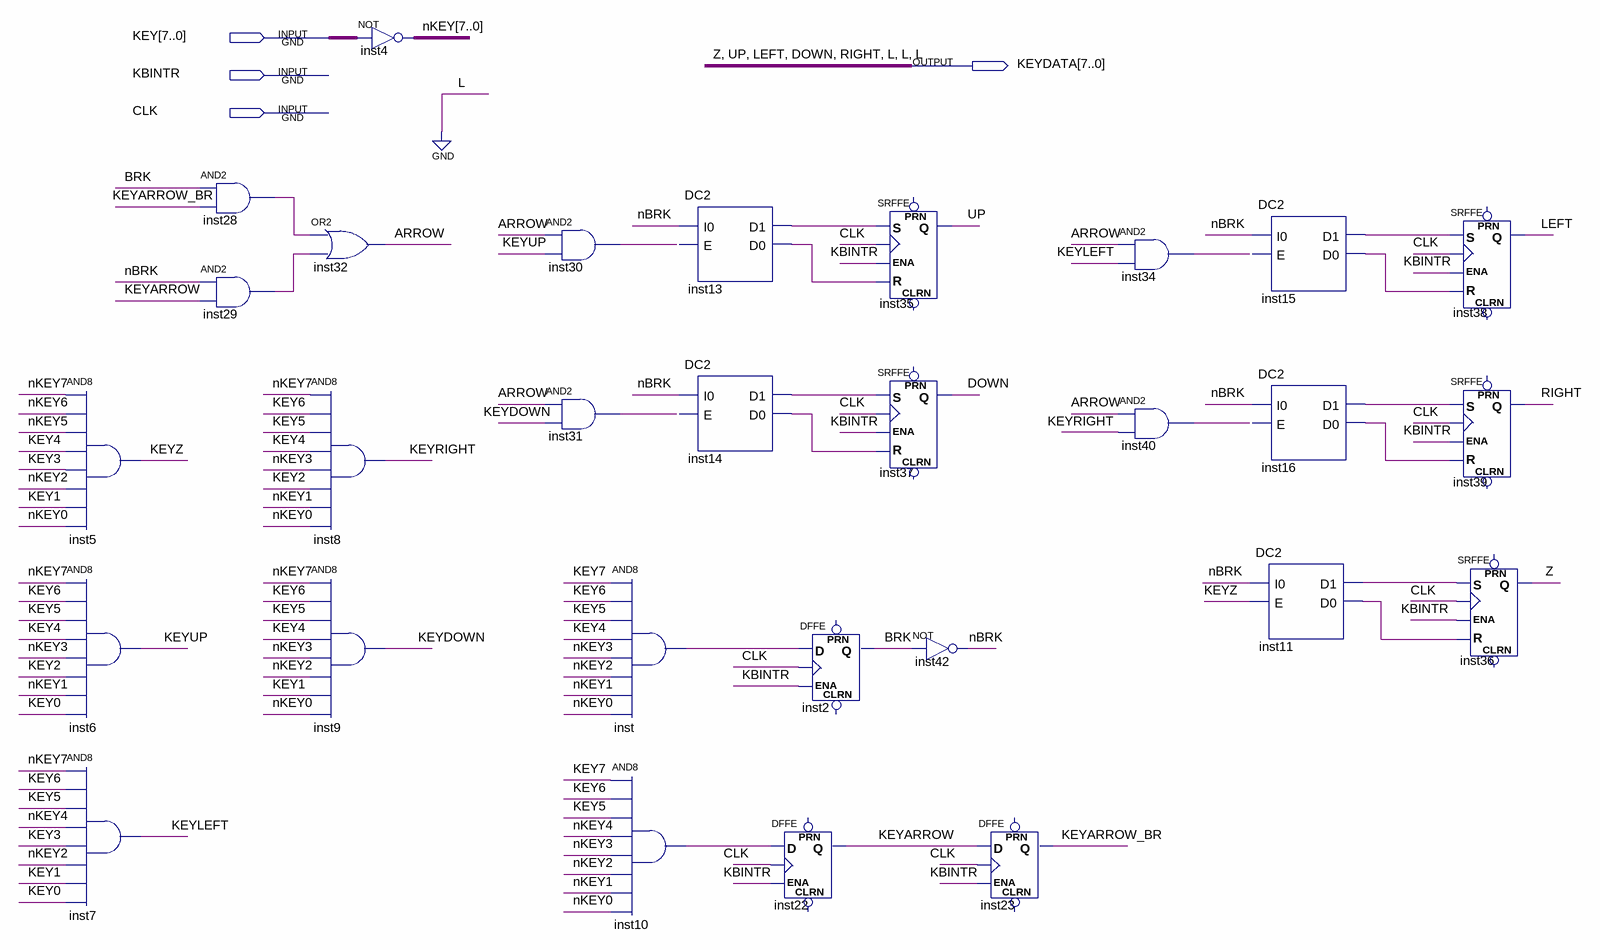
[diagram p0: schematic sheet]
// Quartus schematic CodeInterpeter.bdf as structural Verilog: 29 symbols, 4 pins
module CodeInterpeter (
  input  [7:0] KEY,
  input  KBINTR,
  input  CLK,
  output [7:0] KEYDATA
);

  wire ARROW, BRK, inst10_out, inst11_d0, inst11_d1, inst13_d0, inst13_d1, inst14_d0, inst14_d1, inst15_d0,
       inst15_d1, inst16_d0, inst16_d1, inst28_out, inst29_out, inst30_out, inst31_out, inst34_out,
       inst40_out, inst_out, KEYARROW, KEYARROW_BR, KEYDOWN, KEYLEFT, KEYRIGHT, KEYUP, KEYZ, nBRK;
  wire [7:0] nKEY;

  and inst5 (KEYZ, nKEY[7], nKEY[6], nKEY[5], KEY[4], KEY[3], nKEY[2], KEY[1], nKEY[0]);
  and inst6 (KEYUP, nKEY[7], KEY[6], KEY[5], KEY[4], nKEY[3], KEY[2], nKEY[1], KEY[0]);
  and inst7 (KEYLEFT, nKEY[7], KEY[6], KEY[5], nKEY[4], KEY[3], nKEY[2], KEY[1], KEY[0]);
  and inst28 (inst28_out, BRK, KEYARROW_BR);
  and inst29 (inst29_out, nBRK, KEYARROW);
  or inst32 (ARROW, inst28_out, inst29_out);
  and inst8 (KEYRIGHT, nKEY[7], KEY[6], KEY[5], KEY[4], nKEY[3], KEY[2], nKEY[1], nKEY[0]);
  and inst9 (KEYDOWN, nKEY[7], KEY[6], KEY[5], KEY[4], nKEY[3], nKEY[2], KEY[1], nKEY[0]);
  assign nKEY = ~KEY;  // NOT inst4, 8 bits wide
  and inst30 (inst30_out, ARROW, KEYUP);
  and inst31 (inst31_out, ARROW, KEYDOWN);
  and inst (inst_out, KEY[7], KEY[6], KEY[5], KEY[4], nKEY[3], nKEY[2], nKEY[1], nKEY[0]);
  and inst10 (inst10_out, KEY[7], KEY[6], KEY[5], nKEY[4], nKEY[3], nKEY[2], nKEY[1], nKEY[0]);
  DC2 inst13 (.I0(nBRK), .D1(inst13_d1), .D0(inst13_d0));  // open: E
  DC2 inst14 (.I0(nBRK), .D1(inst14_d1), .D0(inst14_d0));  // open: E
  DFFE inst22 (.D(inst10_out), .CLK(CLK), .ENA(KBINTR), .Q(KEYARROW));  // open: PRN, CLRN
  DFFE inst2 (.D(inst_out), .CLK(CLK), .ENA(KBINTR), .Q(BRK));  // open: PRN, CLRN
  SRFFE inst35 (.S(inst13_d1), .CLK(CLK), .R(inst13_d0), .ENA(KBINTR), .Q(KEYDATA[6]));  // open: PRN, CLRN
  SRFFE inst37 (.S(inst14_d1), .CLK(CLK), .R(inst14_d0), .ENA(KBINTR), .Q(KEYDATA[4]));  // open: PRN, CLRN
  not inst42 (nBRK, BRK);
  DFFE inst23 (.D(KEYARROW), .CLK(CLK), .ENA(KBINTR), .Q(KEYARROW_BR));  // open: PRN, CLRN
  and inst34 (inst34_out, ARROW, KEYLEFT);
  and inst40 (inst40_out, ARROW, KEYRIGHT);
  DC2 inst15 (.I0(nBRK), .D1(inst15_d1), .D0(inst15_d0));  // open: E
  DC2 inst16 (.I0(nBRK), .D1(inst16_d1), .D0(inst16_d0));  // open: E
  DC2 inst11 (.I0(nBRK), .E(KEYZ), .D1(inst11_d1), .D0(inst11_d0));
  SRFFE inst38 (.S(inst15_d1), .CLK(CLK), .R(inst15_d0), .ENA(KBINTR), .Q(KEYDATA[5]));  // open: PRN, CLRN
  SRFFE inst39 (.S(inst16_d1), .CLK(CLK), .R(inst16_d0), .ENA(KBINTR), .Q(KEYDATA[3]));  // open: PRN, CLRN
  SRFFE inst36 (.S(inst11_d1), .CLK(CLK), .R(inst11_d0), .ENA(KBINTR), .Q(KEYDATA[7]));  // open: PRN, CLRN

  assign KEYDATA[2:0] = 3'b000;

  // Other names for the same wires on the sheet: DOWN = KEYDATA[4]; LEFT = KEYDATA[5]; RIGHT = KEYDATA[3];
  //   UP = KEYDATA[6]; Z = KEYDATA[7]
endmodule
